# Altium schematic sheet VOLTAGE_SOURCE.SchDoc: Voltage Source
size B; ApprovedBy: Nhatkhongbuon; Author: Nhatkhongbuon; Organization: Tecotec; Address1: CT3ABlock Me Tri Thuong; Address2: Urban Zone; SheetNumber: 1; SheetTotal: 4; ProjectTitle: Tecotec_GYT_Rx
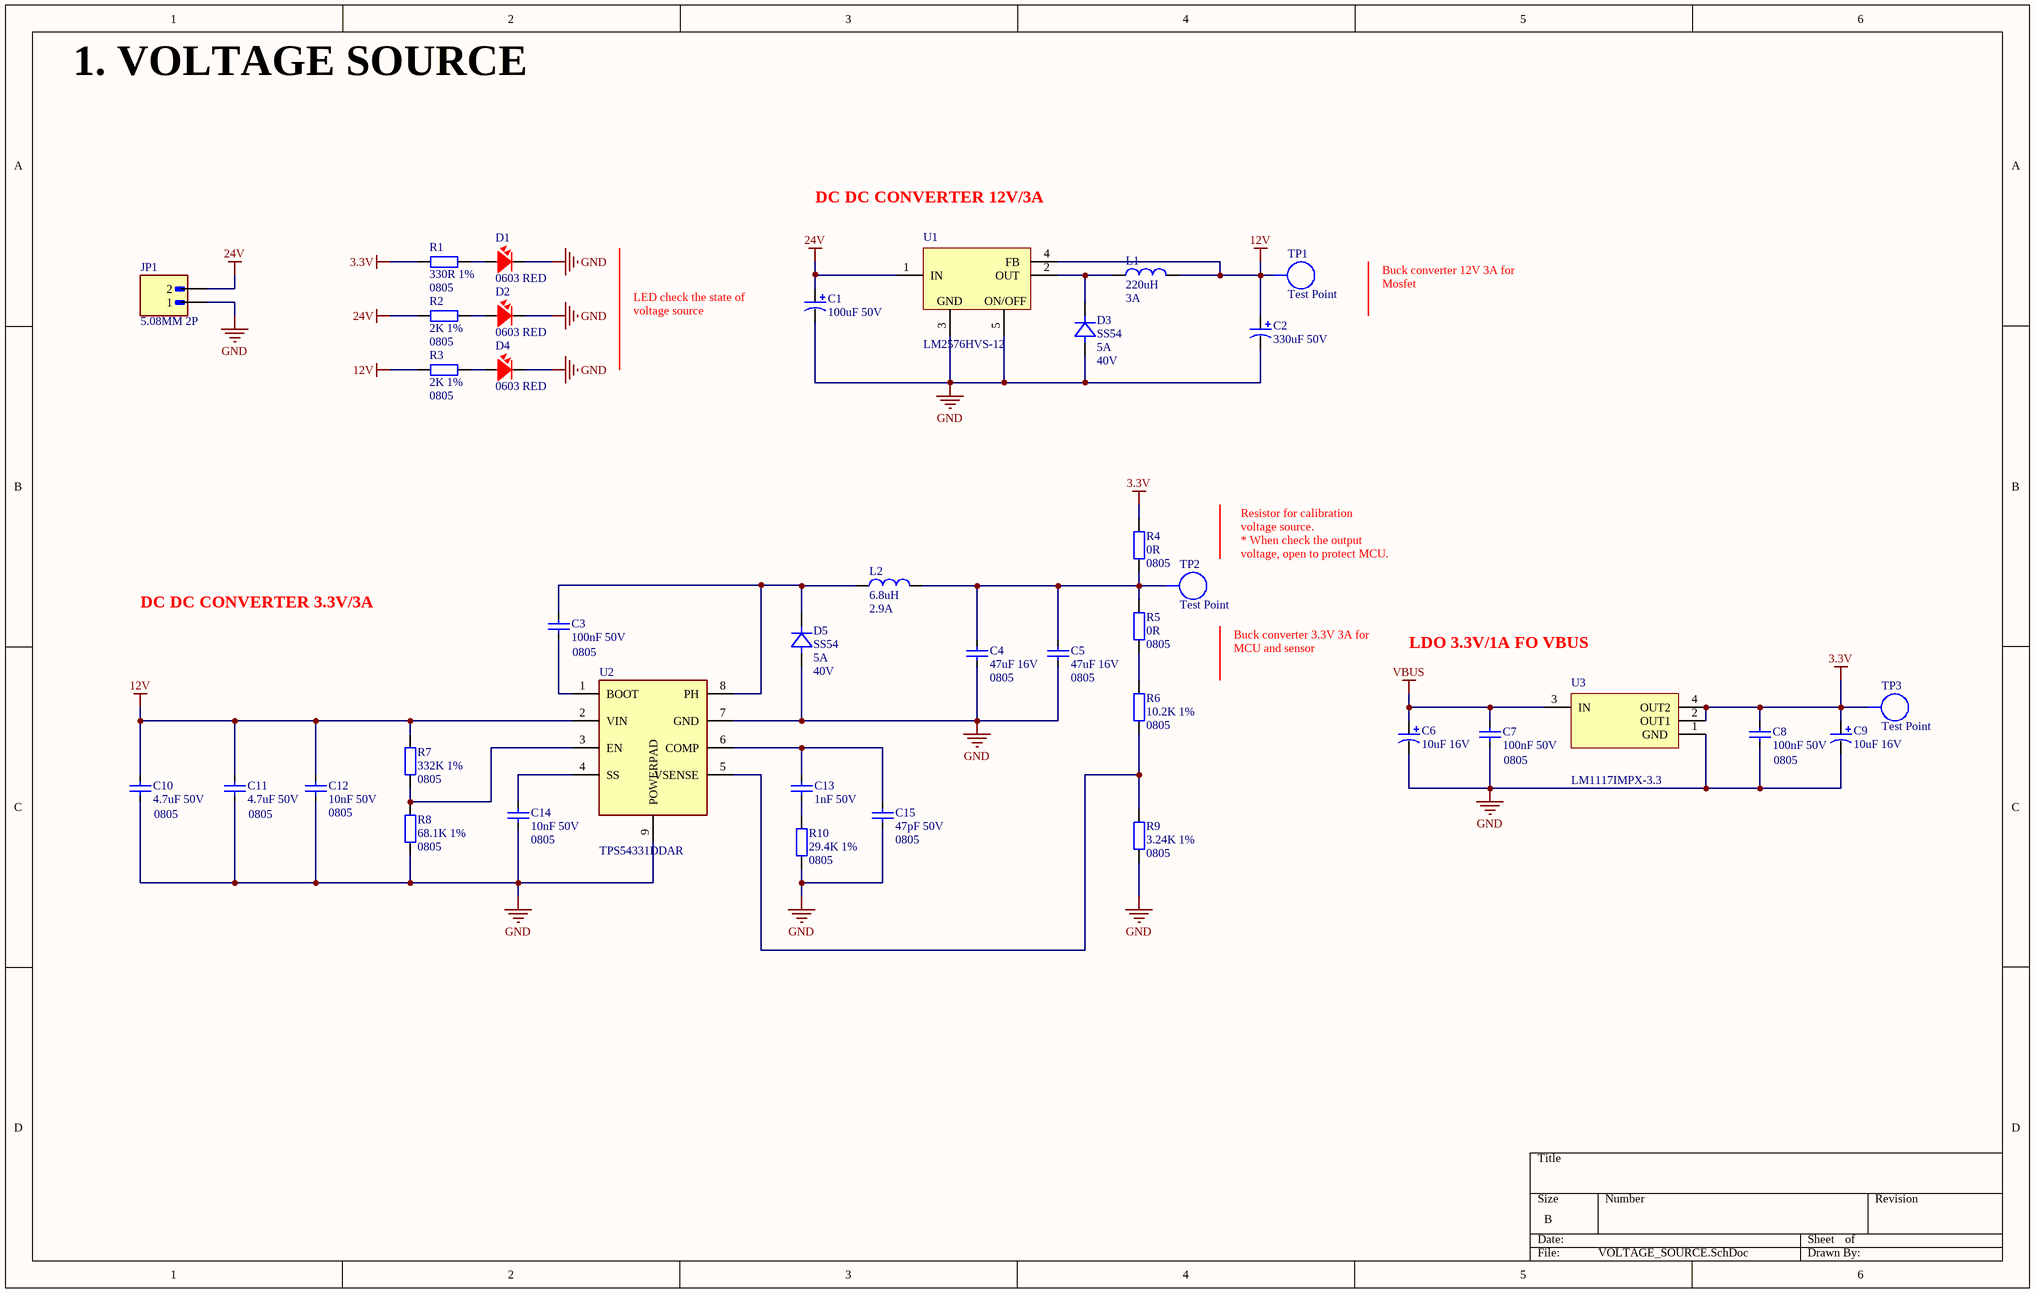
[diagram p0: VOLTAGE_SOURCE.SchDoc]

## Parts
C1  100uF 50V  [CAP-ALU-SMD-F-NEW]
C2  330uF 50V  [CAP-ALU-SMD-G-NEW]
C3  100nF 50V  Size: 0805  [CAP_SMD_0805_NEW]
C4  47uF 16V  Size: 0805  [CAP_SMD_0805_NEW]
C5  47uF 16V  Size: 0805  [CAP_SMD_0805_NEW]
C6  10uF 16V  [CAP-ALU-SMD-B -NEW]
C7  100nF 50V  Size: 0805  [CAP_SMD_0805_NEW]
C8  100nF 50V  Size: 0805  [CAP_SMD_0805_NEW]
C9  10uF 16V  [CAP-ALU-SMD-B -NEW]
C10  4.7uF 50V  Size: 0805  [CAP_SMD_0805_NEW]
C11  4.7uF 50V  Size: 0805  [CAP_SMD_0805_NEW]
C12  10nF 50V  Size: 0805  [CAP_SMD_0805_NEW]
C13  1nF 50V  [CAP_SMD_0805_NEW]
C14  10nF 50V  Size: 0805  [CAP_SMD_0805_NEW]
C15  47pF 50V  Size: 0805  [CAP_SMD_0805_NEW]
D1  0603 RED  [LED-0603]
D2  0603 RED  [LED-0603]
D3  SS54  Current: 5A  DC Voltage: 40V  [SMA]
D4  0603 RED  [LED-0603]
D5  SS54  Current: 5A  DC Voltage: 40V  [SMA]
JP1  5.08MM 2P  [5.08MM 2P]
L1  Inductor: 220uH  Current: 3A  [L_TOR_13x7]  (hidden comment: 220uH 3A)
L2  Inductor: 6.8uH  Current: 2.9A  [CD74R]  (hidden comment: CD74R_6.8uH)
R1  330R 1%  Size: 0805  [RES_SMD_0805]
R2  2K 1%  Size: 0805  [RES_SMD_0805]
R3  2K 1%  Size: 0805  [RES_SMD_0805]
R4  0R  Size: 0805  [RES_SMD_0805]
R5  0R  Size: 0805  [RES_SMD_0805]
R6  10.2K 1%  Size: 0805  [RES_SMD_0805]
R7  332K 1%  Size: 0805  [RES_SMD_0805]
R8  68.1K 1%  Size: 0805  [RES_SMD_0805]
R9  3.24K 1%  Size: 0805  [RES_SMD_0805]
R10  29.4K 1%  Size: 0805  [RES_SMD_0805]
TP1  Test Point  [TEST_POINT]
TP2  Test Point  [TEST_POINT]
TP3  Test Point  [TEST_POINT]
U1  LM2576HVS-12  [IC_LM2596SX-12/NOPB]
U2  TPS54331DDAR  [TPS54531DDAR]
U3  LM1117IMPX-3.3  [SOT-223-4]

## Nets
3.3V: C8.2 C9.1 R1.1 R4.2 TP3.1 U3.2(OUT1) U3.4(OUT2)
12V: C2.1 C10.2 C11.2 C12.2 L1.2 R3.2 R7.2 TP1.1 U1.4(FB) U2.2(VIN)
24V: C1.1 JP1.2 R2.2 U1.1(IN)
GND: C1.2 C2.2 C4.1 C5.1 C6.2 C7.1 C8.1 C9.2 C10.1 C11.1 C12.1 C14.1 C15.1 D1.2 D2.2 D3.A D4.2 D5.A JP1.1 R8.1 R9.1 R10.1 U1.3(GND) U1.5(ON/OFF) U2.7(GND) U2.9(POWERPAD) U3.1(GND)
VBUS: C6.1 C7.2 U3.3(IN)
NetC3_1: C3.1 U2.1(BOOT)
NetC3_2: C3.2 D5.C L2.1 U2.8(PH)
NetC4_2: C4.2 C5.2 L2.2 R4.1 R5.2 TP2.1
NetC13_1: C13.1 R10.2
NetC13_2: C13.2 C15.2 U2.6(COMP)
NetC14_2: C14.2 U2.4(SS)
NetD1_1: D1.1 R1.2
NetD2_1: D2.1 R2.1
NetD3_C: D3.C L1.1 U1.2(OUT)
NetD4_1: D4.1 R3.1
NetR5_1: R5.1 R6.2
NetR6_1: R6.1 R9.2 U2.5(VSENSE)
NetR7_1: R7.1 R8.2 U2.3(EN)

## Notes on the sheet
- 1. VOLTAGE SOURCE
- DC DC CONVERTER 12V/3A
- (near C1) LED check the state of voltage source
- Buck converter 12V 3A for Mosfet
- DC DC CONVERTER 3.3V/3A
- Resistor for calibration voltage source.
  * When check the output voltage, open to protect MCU.
- Buck converter 3.3V 3A for MCU and sensor
- LDO 3.3V/1A FO VBUS
- Author:
- Title:
- Size:
- A4
- Project:
- Approved:
- Revision:
- Modified Date:
- CONFIDENTIAL
- Date:
- SW Version:
- (in symbol LM1117IMPX-3.3/NOPB) /
- (in symbol LM2576HVS-12) /

## Library data of the parts
C1 = C_ALU_100uF_50V_F: 100uF 50V 140mA@120Hz ±20% SMD,D8xL10mm Aluminum Electrolytic Capacitors - SMD ROHS; Manufacturer: Nichicon; Manufacture Part Number: UWT1H101MNL1GS; Link: https://jlcpcb.com/partdetail/Nichicon-UWT1H101MNL1GS/C445063?spm=searchList; Price: $0.1311
C2 = C_ALU_330uF_50V_G: 330uF 50V 170mA@120Hz ±20% SMD,D10xL10.2mm Aluminum Electrolytic Capacitors - SMD ROHS; Manufacturer: KNSCHA; Manufacture Part Number: RVT330UF50V167RV085; Packaging: Cut Tape (CT); Link: https://jlcpcb.com/partdetail/KNSCHA-RVT330UF50V167RV085/C5155333; Price: $0.0941
C3 C7 C8 = C0805_MLCC_100nF_50V: 0.1 µF ±10% 50V Ceramic Capacitor X7R 0805 (2012 Metric); Manufacturer: YAGEO; Manufacture Part Number: CC0805KRX7R9BB104; Packaging: Cut Tape (CT); Link: https://www.digikey.cn/en/products/detail/yageo/CC0805KRX7R9BB104/302874; Price: $0.10
C4 C5 = C0805_MLCC_47uF_16V: 47 µF ±10% 16V Ceramic Capacitor X5R 1210 (3225 Metric); Manufacturer: Samsung Electro-Mechanics; Manufacture Part Number: CL32A476KOJNNNE; Packaging: Cut Tape (CT); Link: https://www.digikey.cn/en/products/detail/samsung-electro-mechanics/CL32A476KOJNNNE/3889034; Price: $0.51
C6 C9 = C_ALU_10uF_16V_B: 10uF 16V 14mA@120Hz ±20% SMD,D4xL5.4mm Aluminum Electrolytic Capacitors - SMD ROHS; Manufacturer: KNSCHA; Manufacture Part Number: RST10UF16V013; Packaging: Cut Tape (CT); Link: https://www.lcsc.com/product-detail/Aluminum-Electrolytic-Capacitors-SMD_KNSCHA-RST10UF16V013_C4747968.html; Price: $0.0217; Size: B
C10 C11 = C0805_MLCC_4.7uF_50V: 4.7 µF ±10% 50V Ceramic Capacitor X5R 0805 (2012 Metric); Manufacturer: Samsung Electro-Mechanics; Manufacture Part Number: CL21A475KBQNNNE; Packaging: Cut Tape (CT); Link: https://www.digikey.cn/en/products/detail/samsung-electro-mechanics/CL21A475KBQNNNE/3886906; Price: $0.23
C12 C14 = C0805_MLCC_10nF_50V: 10000 pF ±10% 50V Ceramic Capacitor X7R 0805 (2012 Metric); Manufacturer: Samsung Electro-Mechanics; Manufacture Part Number: CL21B103KBANNNC; Packaging: Cut Tape (CT); Link: https://www.digikey.cn/en/products/detail/samsung-electro-mechanics/CL21B103KBANNNC/3886673; Price: $0.10
C13 = C0805_MLCC_1nF_50V: 1000 pF ±5% 50V Ceramic Capacitor C0G, NP0 0805 (2012 Metric); Manufacturer: KEMET; Manufacture Part Number: C0805C102J5GAC7800; Packaging: Cut Tape (CT); Link: https://www.digikey.cn/en/products/detail/kemet/C0805C102J5GAC7800/411135; Price: $0.11; Size: 0805
C15 = C0805_MLCC_47pF_50V: 47 pF ±5% 50V Ceramic Capacitor C0G, NP0 0805 (2012 Metric); Manufacturer: YAGEO; Manufacture Part Number: CC0805JRNPO9BN470; Packaging: Cut Tape (CT); Link: https://www.digikey.cn/en/products/detail/yageo/CC0805JRNPO9BN470/302841; Price: $0.10
D1 D2 D4 = LED_0603_RED: Red 625nm LED Indication - Discrete 2V 0603 (1608 Metric); Manufacturer: Würth Elektronik; Manufacture Part Number: 150060RS75000; Packaging: Cut Tape (CT); Link: https://www.digikey.cn/en/products/detail/w%C3%BCrth-elektronik/150060RS75000/4489901; Price: $0.15
D3 D5 = SS54: DIODE SCHOTTKY 40V 5A SMA; Manufacturer: EVVO; Manufacture Part Number: SS54; Packaging: Cut Tape (CT); Link: https://www.digikey.cn/en/products/detail/evvo/SS54/21407219; Price: $0.73
JP1 = TERMINAL_5.08MM_2P: 2 Position Terminal Block Header, Male Pins, Shrouded (2 Side) 0.200" (5.08mm) 90°, Right Angle Through Hole; Manufacturer: Phoenix Contact; Manufacture Part Number: 1759017; Packaging: Bulk; Link: https://www.digikey.cn/en/products/detail/phoenix-contact/1759017/260463?s=N4IgTCBcDaIIwHYCsBOADIkBdAvkA; Price: $0.58
L1 = L_220uH_3A_LM2576: Link: https://banlinhkien.com/cuon-cam-220uh-3a-lm2576-p6646202.html
L2 = CD74R_6.8uH: 2.9A 6.8uH ±30% SMD,7.5x7.5mm Power Inductors ROHS; Manufacturer: SHOU HAN; Manufacture Part Number: CYH74-6.8UH; Link: https://www.lcsc.com/product-detail/Power-Inductors_SHOU-HAN-CYH74-6-8UH_C19268626.html; Price: $ 0.0674
R1 = R0805_330R: 330 Ohms ±1% 0.125W, 1/8W Chip Resistor 0805 (2012 Metric) Automotive AEC-Q200 Thick Film; Manufacturer: Stackpole Electronics Inc; Manufacture Part Number: RMCF0805FT330R; Packaging: Cut Tape (CT); Link: https://www.digikey.cn/en/products/detail/stackpole-electronics-inc/RMCF0805FT330R/1760484; Price: $0.10
R2 R3 = R0805_2K: 2 kOhms ±1% 0.125W, 1/8W Chip Resistor 0805 (2012 Metric) Automotive AEC-Q200 Thick Film; Manufacturer: Panasonic Electronic Components; Manufacture Part Number: ERJ-6ENF2001V; Packaging: Cut Tape (CT); Link: https://www.digikey.com/en/products/detail/panasonic-electronic-components/ERJ-6ENF2001V/111341; Price: $0.10
R4 R5 = R0805_0R: 0 Ohms Jumper Chip Resistor 0805 (2012 Metric) Automotive AEC-Q200 Thick Film; Manufacturer: Vishay Dale; Manufacture Part Number: CRCW08050000Z0EA; Packaging: Cut Tape (CT); Link: https://www.digikey.cn/en/products/detail/vishay-dale/CRCW08050000Z0EA/1175125; Price: $0.10
R6 = R0805_10.2K: 10.2 kOhms ±1% 0.125W, 1/8W Chip Resistor 0805 (2012 Metric) Moisture Resistant Thick Film; Manufacturer: YAGEO; Manufacture Part Number: RC0805FR-0710K2L; Packaging: Cut Tape (CT); Link: https://www.digikey.cn/en/products/detail/yageo/RC0805FR-0710K2L/727538; Price: $0.10
R7 = R0805_332K: 332 kOhms ±1% 0.125W, 1/8W Chip Resistor 0805 (2012 Metric) Moisture Resistant Thick Film; Manufacturer: YAGEO; Manufacture Part Number: RC0805FR-07332KL; Packaging: Cut Tape (CT); Price: $0.10; Link: https://www.digikey.cn/en/products/detail/yageo/RC0805FR-07332KL/727869
R8 = R0805_68.1K: 68.1 kOhms ±1% 0.125W, 1/8W Chip Resistor 0805 (2012 Metric) Moisture Resistant Thick Film; Manufacturer: YAGEO; Manufacture Part Number: RC0805FR-0768K1L; Packaging: Cut Tape (CT); Price: $0.10; Link: https://www.digikey.cn/en/products/detail/yageo/RC0805FR-0768K1L/728100?s=N4IgTCBcDaIEoGEAMAOJBWAYnAtEg7AGwoDSAjADIgC6AvkA
R9 = R0805_3.24K: 3.24 kOhms ±1% 0.125W, 1/8W Chip Resistor 0805 (2012 Metric) Moisture Resistant Thick Film; Manufacturer: YAGEO; Manufacture Part Number: RC0805FR-073K24L; Packaging: Cut Tape (CT); Link: https://www.digikey.cn/en/products/detail/yageo/RC0805FR-073K24L/727811; Price: $0.10
R10 = R0805_29.4K: 29.4 kOhms ±1% 0.125W, 1/8W Chip Resistor 0805 (2012 Metric) Moisture Resistant Thick Film; Manufacturer: YAGEO; Manufacture Part Number: RC0805FR-0729K4L; Packaging: Cut Tape (CT); Price: $0.10; Link: https://www.digikey.cn/en/products/detail/yageo/RC0805FR-0729K4L/727796
TP1-TP3 = TEST_POINT
U1 = LM2576HVS-12: Switching Voltage Regulators SIMPLE SWITCHER&reg; 4V to 60V, 3A Low Component Count Step-Down Regulator 5-DDPAK/TO-263 -40 to 125; Manufacturer: Texas Instruments; Manufacture Part Number: LM2576HVS-12; Packaging: Tube; Link: https://www.mouser.vn/ProductDetail/Texas-Instruments/LM2576HVS-12?qs=X1J7HmVL2ZG26yVYlinkCQ%3D%3D; Price: $11.83
U2 = TPS54331DDAR: Buck Switching Regulator IC Positive Adjustable 0.8V 1 Output 3A 8-PowerSOIC (0.154", 3.90mm Width); Manufacturer: Texas Instruments; Manufacture Part Number: TPS54331DDAR; Packaging: Cut Tape; Link: https://www.digikey.cn/en/products/detail/texas-instruments/TPS54331DDAR/3053257; Price: $1.88
U3 = LM1117IMPX-3.3/NOPB: Linear Voltage Regulator IC Positive Fixed 1 Output 800mA SOT-223-4; Manufacturer: Texas Instruments; Manufacture Part Number: LM1117IMPX-3.3/NOPB; Packaging: Cut Tape (CT); Link: https://www.digikey.cn/en/products/detail/texas-instruments/LM1117IMPX-3-3-NOPB/1870906; Price: $1.14